# EasyEDA schematic SCH_HackerCardV2_2025-07-10 (1).json
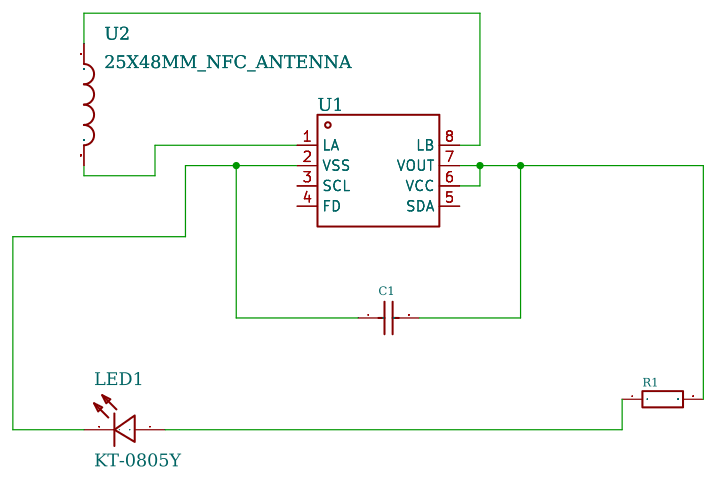
[diagram p0: schematic sheet]

## Parts
C1  220nF  [C0805]
LED1  KT-0805Y  [LED0805-R-RD]
R1  47Ω  [R0603]
U1  13.56MHz  [XQFN-8_L1.6-W1.6-P0.50-BL_NT3H2111W0FHKH]
U2  25X48MM_NFC_ANTENNA  [25X48MM_NFC_ANTENNA]

## Library data of the parts
C1 = -: Symbol: CL21B224KBFNNNE; Device: CL21B224KBFNNNE; Supplier: LCSC; Manufacturer Part: CL21B224KBFNNNE; Manufacturer: SAMSUNG(三星); Supplier Part: C5378; LCSC Part Name: 220nF ±10% 50V; Supplier Footprint: 0805; Datasheet: https://atta.szlcsc.com/upload/public/pdf/source/20160218/1457707763339.pdf; Add into BOM: yes; Convert to PCB: yes; Tolerance: ±10%
LED1 = -: Symbol: 17-21SUYC/TR8; LCSC Part Name: 0805 黄灯 高亮; Supplier Part: C2296; Manufacturer: KENTO; Supplier Footprint: 0805; JLCPCB Part Class: Basic Part; Datasheet: https://atta.szlcsc.com/upload/public/pdf/source/20160421/1461205044170.pdf; Supplier: LCSC; Add into BOM: yes; Convert to PCB: yes; Emitted Color: Yellow
R1 = -: Symbol: 0603WAF470JT5E; Device: 0603WAF470JT5E; Supplier: LCSC; Manufacturer: UNI-ROYAL(厚声); Manufacturer Part: 0603WAF470JT5E; Supplier Part: C23182; JLCPCB Part Class: Basic Part; LCSC Part Name: 47Ω ±1% 100mW 厚膜电阻; Supplier Footprint: 0603; Datasheet: https://atta.szlcsc.com/upload/public/pdf/source/20200306/C422600_1E6D84923E4A46A82E41ADD87F860B5C.pdf; Add into BOM: yes; Convert to PCB: yes; Type: Thick Film Resistors; Tolerance: ±1%; Temperature Coefficient: ±100ppm/℃; Operating Temperature Range: -55℃+155℃
U1 = -: Symbol: NT3H2111W0FHKH; Device: NT3H2111W0FHKH; LCSC Part Name: NT3H2111W0FHKH; Supplier Part: C710403; Manufacturer: NXP(恩智浦); Manufacturer Part: NT3H2111W0FHKH; Supplier Footprint: XQFN-8(1.6x1.6); Datasheet: https://www.nxp.com/docs/en/data-sheet/NT3H2111_2211.pdf; Supplier: LCSC; Add into BOM: yes; Convert to PCB: yes; agreement: ISO 14443; interface type: I2C; mains input: 3.3V
U2 = -: Add into BOM: yes; Convert to PCB: yes

## Nets
Net-(C1-1): C1.1 LED1.2(-) U1.2(VSS)
Net-(C1-2): C1.2 R1.2 U1.6(VCC) U1.7(VOUT)
Net-(LED1-1): LED1.1(+) R1.1
Net-(U1-1): U1.1(LA) U2.P$2
Net-(U1-8): U1.8(LB) U2.P$1

Not connected (* = marked no-connect by the designer): U1 3(SCL) 4(FD) 5(SDA)

## Notes on the sheet
- 1
- 2
- 3
- 4
- 5
- 6
- A
- A
- B
- B
- C
- C
- Schematic1
- Create at
- 2025-07-09
- Schematic
- Update at
- 2025-07-09
- Board
- Board1
- Page
- P1
- Drawn
- D
- HackerCardV2
- D
- Reviewed
- Version
- Size
- Page  1  Total  1
- V1.0
- A4
- EasyEDA.com
- 1
- 2
- 3
- 4
- 5
- 6
